# EAGLE design MSP430F5529_Relays_PressureSensor (EAGLE 9.4.1)
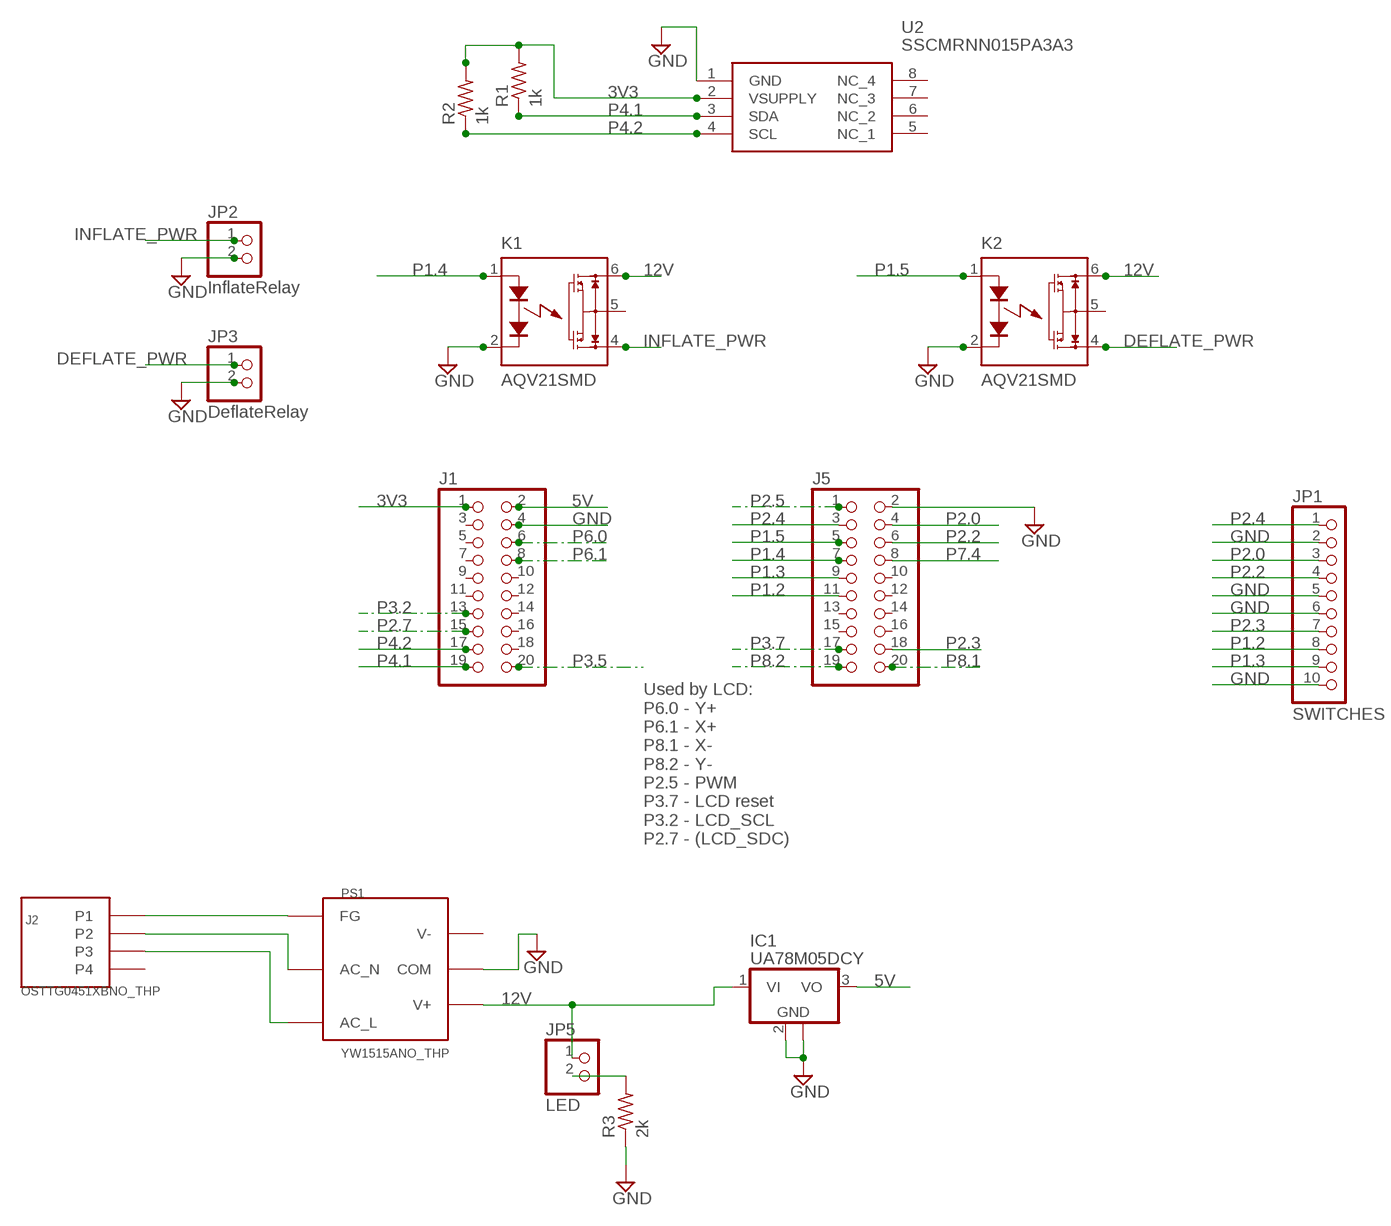
[diagram p0: schematic, sheet 1]

## Parts
IC1  UA78M05DCY  [SOT223]
J1  PINHD-2X10  [2X10]
J2  OSTTG0451XBNO_THP  [TERM_4PIN_5.08MM_NO_THP]
J5  PINHD-2X10  [2X10]
JP1  SWITCHES  PINHD-1X10/90  [1X10/90]
JP2  InflateRelay  PINHD-1X2/90  [1X02/90]
JP3  DeflateRelay  PINHD-1X2/90  [1X02/90]
JP5  LED  PINHD-1X2/90  [1X02/90]
K1  AQV21SMD  [DIL06SMD]
K2  AQV21SMD  [DIL06SMD]
PS1  YW1515ANO_THP  [YW15_NO_THP]
R1  1k  R-US_M1206  [M1206]
R2  1k  R-US_M1206  [M1206]
R3  2k  R-US_M1206  [M1206]
U2  SSCMRNN015PA3A3  [SOP254P1330X598-8N]

## Nets
3V3: J1.1 R1.2 R2.2 U2.2(VSUPPLY)
5V: IC1.3(VO) J1.2
12V: IC1.1(VI) JP5.1 K1.6(D1) K2.6(D1) PS1.P4(V+)
AC_L: J2.P3 PS1.P3(AC_L)
AC_N: J2.P2 PS1.P2(AC_N)
DEFLATE_PWR: JP3.1 K2.4(D2)
FG: J2.P1 PS1.P1(FG)
GND: IC1.2(GND) IC1.4(GND) J1.4 J5.2 JP1.2 JP1.5 JP1.6 JP1.10 JP2.2 JP3.2 K1.2(K) K2.2(K) PS1.P5(COM) R3.1 U2.1(GND)
INFLATE_PWR: JP2.1 K1.4(D2)
N$1: JP5.2 R3.2
P1.2: J5.11 JP1.8
P1.3: J5.9 JP1.9
P1.4: J5.7 K1.1(A)
P1.5: J5.5 K2.1(A)
P2.0: J5.4 JP1.3
P2.2: J5.6 JP1.4
P2.3: J5.18 JP1.7
P2.4: J5.3 JP1.1
P2.5: J5.1
P2.7: J1.15
P3.2: J1.13
P3.5: J1.20
P3.7: J5.17
P4.1: J1.19 R1.1 U2.3(SDA)
P4.2: J1.17 R2.1 U2.4(SCL)
P6.0: J1.6
P6.1: J1.8
P7.4: J5.8
P8.1: J5.20
P8.2: J5.19
Unconnected: J1.3 J1.5 J1.7 J1.9 J1.10 J1.11 J1.12 J1.14 J1.16 J1.18 J2.P4 J5.10 J5.12 J5.13 J5.14 J5.15 J5.16 K1.5(S) K2.5(S) U2.5(NC_1) U2.6(NC_2) U2.7(NC_3) U2.8(NC_4)

## Notes on the sheet
- Used by LCD:
  P6.0 - Y+
  P6.1 - X+
  P8.1 - X-
  P8.2 - Y-
  P2.5 - PWM
  P3.7 - LCD reset
  P3.2 - LCD_SCL
  P2.7 - (LCD_SDC)

## Power pins joined to a net without a drawn wire
V-: PS1.P6(V-)

## Library data of the parts
IC1 = linear:UA78M*: POSITIVE-VOLTAGE REGULATORS Source: http://focus.ti.com/lit/ds/symlink/ua78m33.pdf
J1 J5 = pinhead:PINHD-2X10: PIN HEADER
J2 = MasterSPIS:OSTTG0451XB: OSTTG045100B TERMINAL BLOCK 5.08MM 4POS Angled Screw
JP1 = pinhead:PINHD-1X10: PIN HEADER
JP2 JP3 JP5 = pinhead:PINHD-1X2: PIN HEADER
K1 K2 = relay:AQV*: PhotoMOS Relay NAiS Source: Data sheet <http://www.panasonic-electric-works.com/catalogues/downloads/photomos/ds_x615_en_aqv10_20.pdf>; MF: AROMAT/ MATSUSHITA; MPN: AQV210S; OC_FARNELL: unknown; OC_NEWARK: 95F6433
PS1 = MasterSPIS:YW1515A: Cosel YW15 AC-DC Power supply YW1512A - +/-12V 0.65A YW1515A - +/-12V 0.50A
R1-R3 = resistor:R-US_: RESISTOR, American symbol
U2 = SamacSys_Parts:SSCMRNN015PA3A3: Board Mount Pressure Sensors SMT, Sing Rad Barbed Absolute, 3.3V Source: Datasheet <https://componentsearchengine.com/Datasheets/1/SSCMRNN015PA3A3.pdf>; DESCRIPTION: Board Mount Pressure Sensors SMT, Sing Rad Barbed Absolute, 3.3V; HEIGHT: 5.98mm; MANUFACTURER_NAME: Honeywell; MANUFACTURER_PART_NUMBER: SSCMRNN015PA3A3

## Board
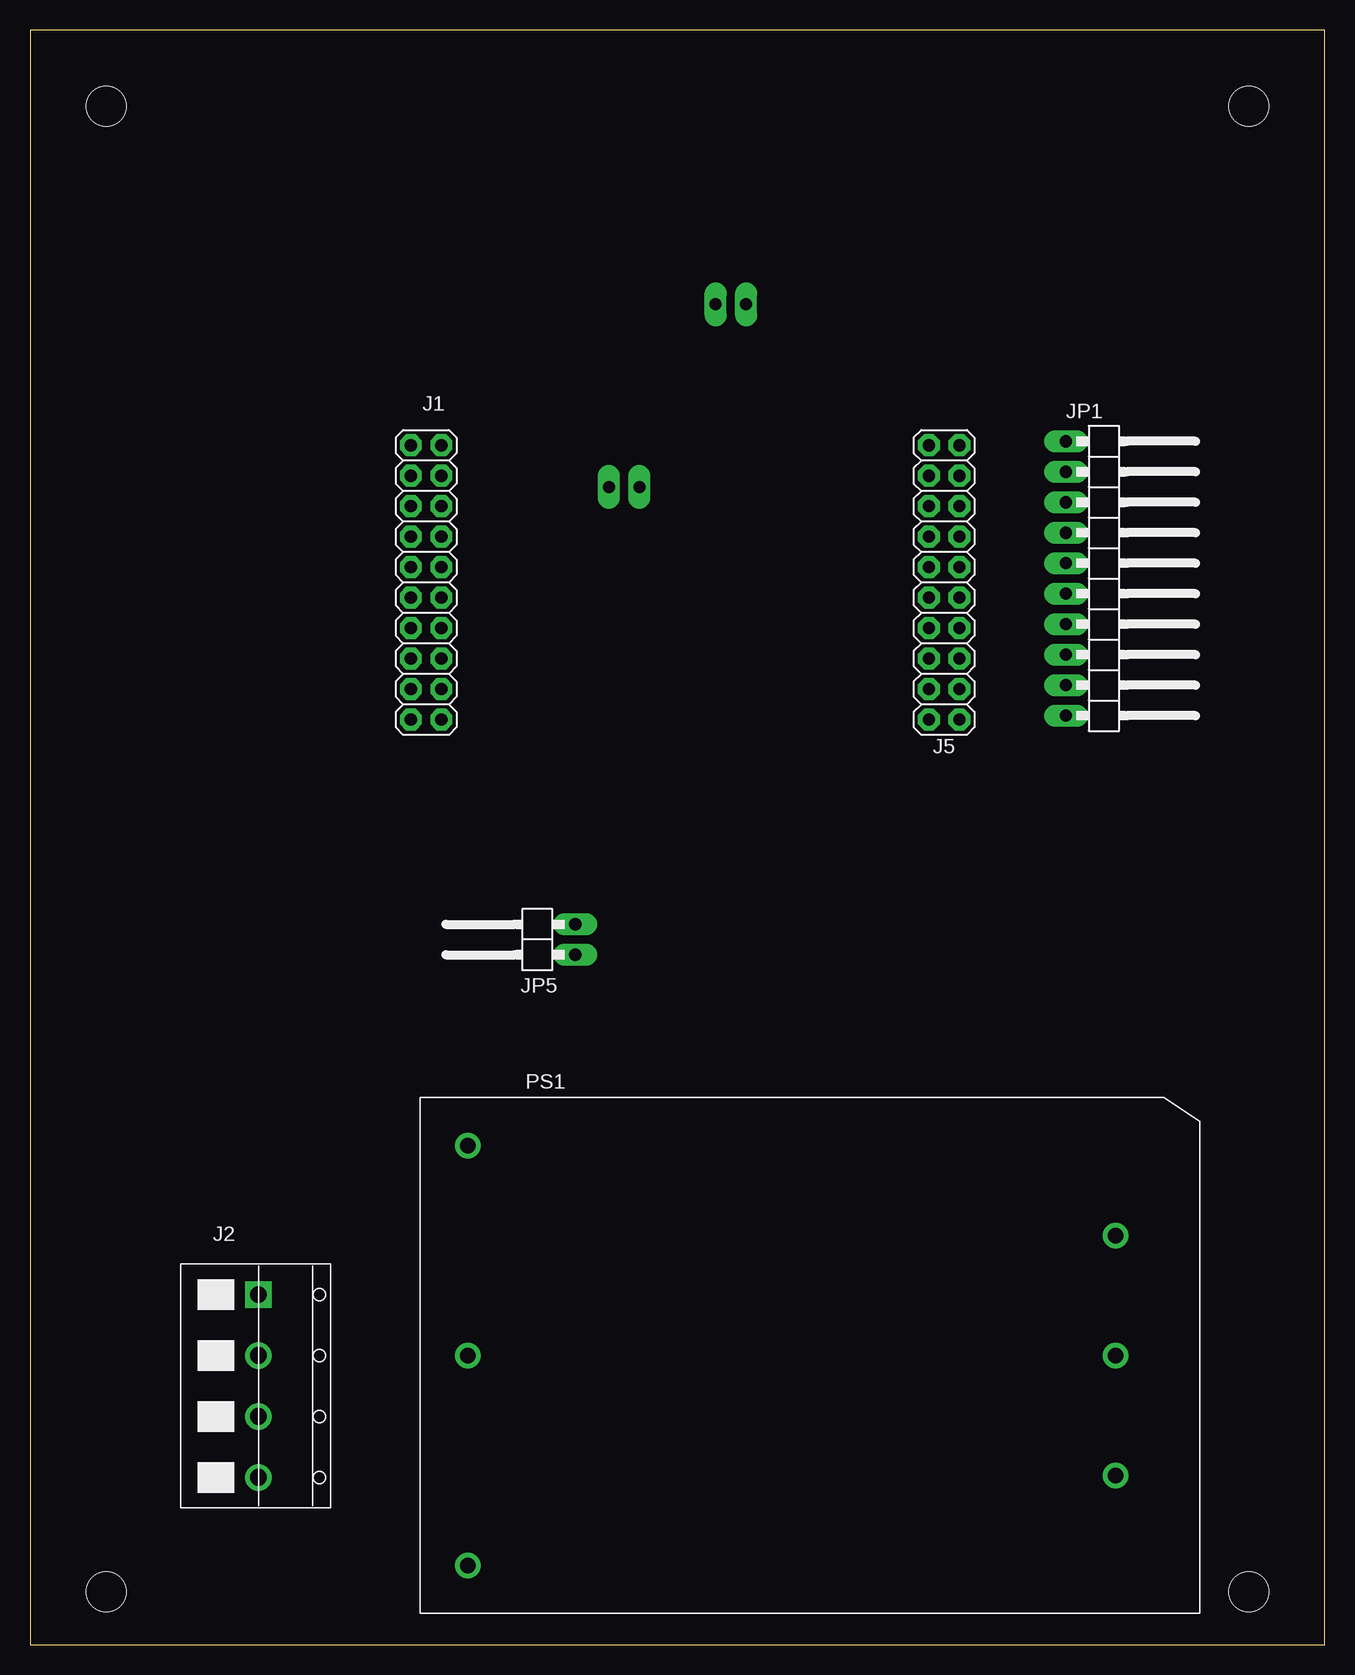
[diagram p1: board, top side]
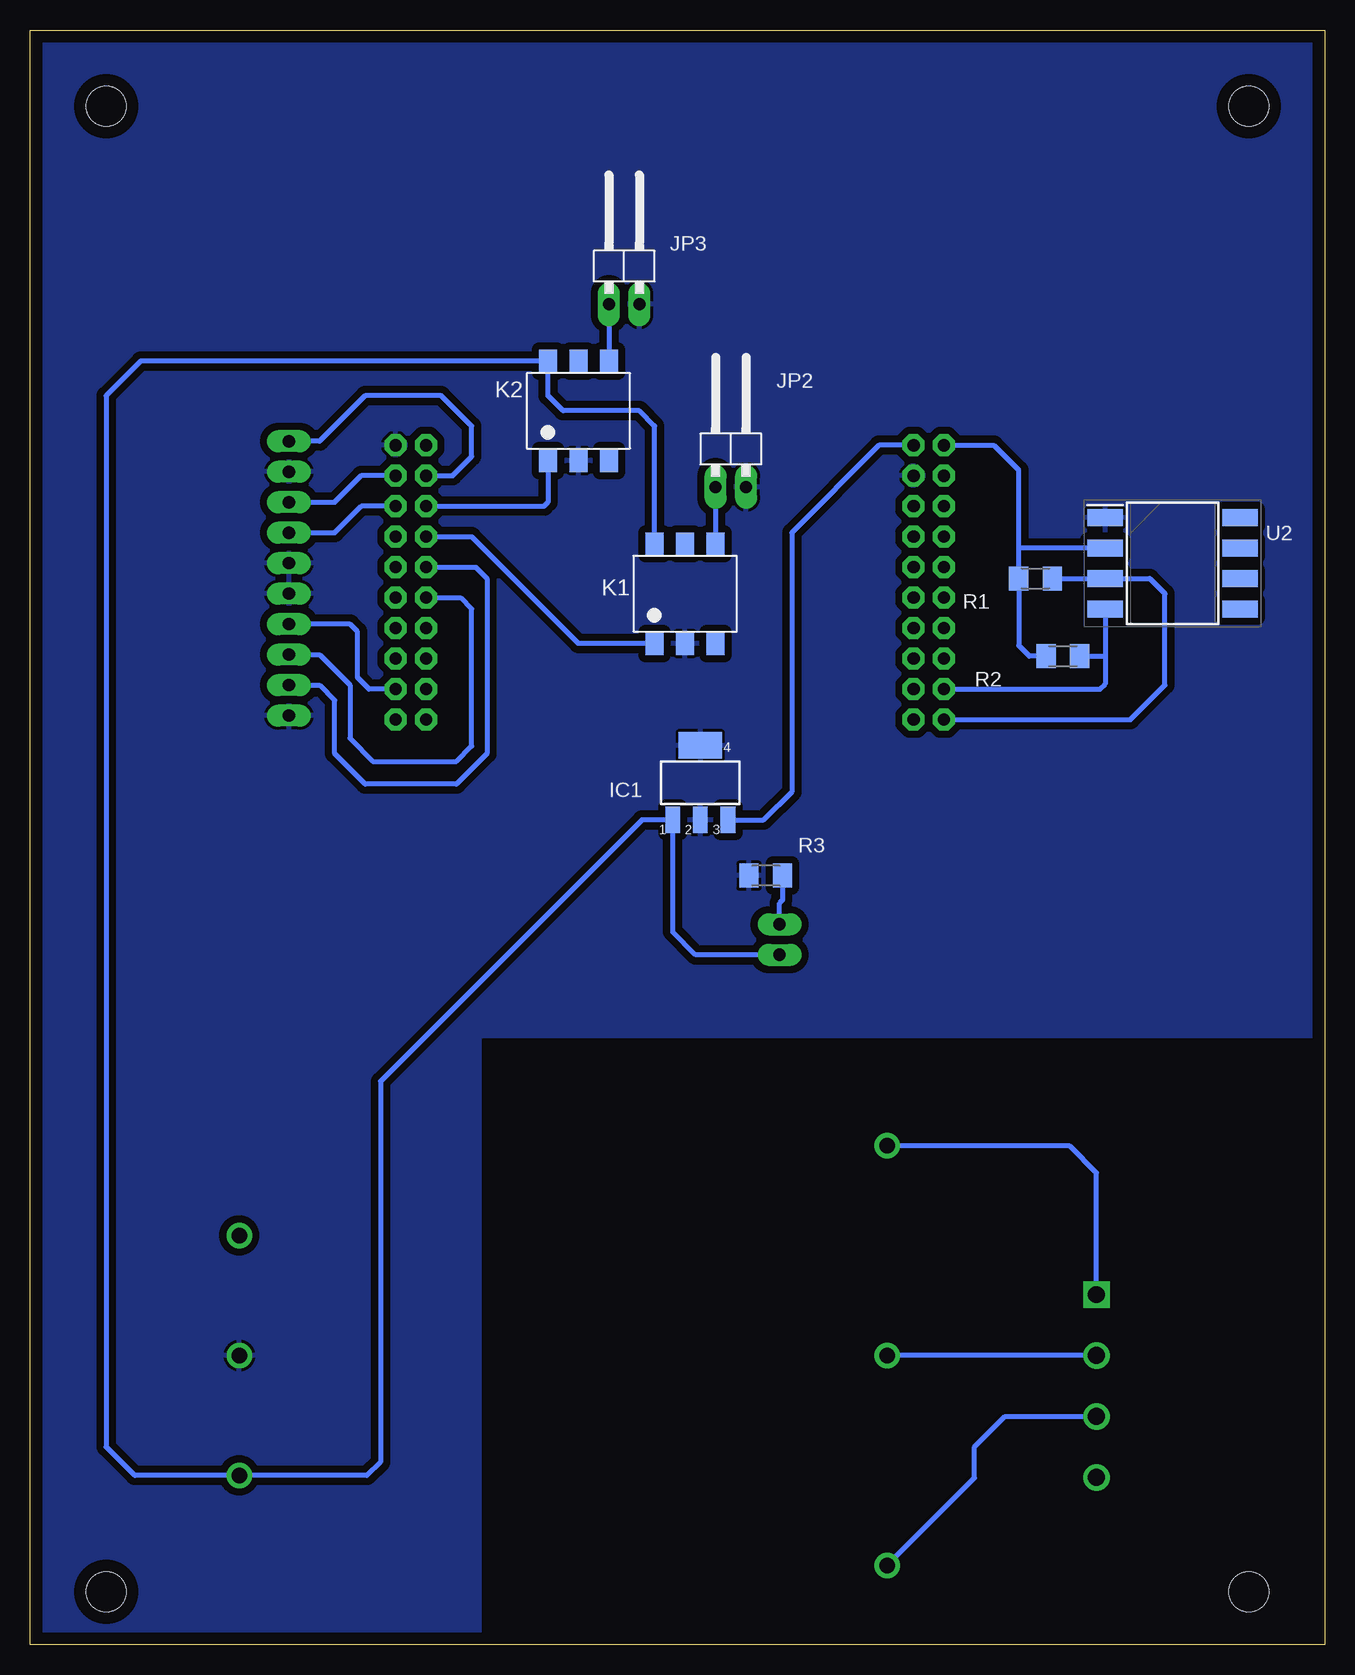
[diagram p2: board, bottom side, seen from below]

Size 107.95 x 134.62 mm. Coordinates in mm from the lower left corner, seen from the top.
Outline: 0,0 107.95,0 107.95,134.62 0,134.62 0,0
Copper layers (1*16): Top 0.035mm / dielectric 1.5mm / Bottom 0.035mm
Design rules "SPIS_LPKF_16mil": minimum track width 10mil, minimum drill 24mil, track to track 16mil, track to pad 16mil, pad to pad 16mil, via to via 16mil, smd to smd 16mil, copper to edge 40mil, drill to drill 8mil, minimum pad ring 16mil, minimum via ring 16mil, stop-mask expansion 4mil, vias tented up to drill 0mil, thermal gap 10mil
Holes 3.3 mm at 6.35,128.27 101.6,128.27 101.6,4.44 6.35,4.44

### Footprints (pad centres in the part's own frame; a part is rotated, then mirrored left to right if it is on the bottom)
SOT223 = smd 1.219 x 2.235: 1 -2.311,-3.099; 2 0,-3.099; 3 2.311,-3.099 | smd 3.6 x 2.2: 4 0,3.099
2X10 = drill 1.016 octagon: 1 -11.43,-1.27; 2 -11.43,1.27; 3 -8.89,-1.27; 4 -8.89,1.27; 5 -6.35,-1.27; 6 -6.35,1.27; 7 -3.81,-1.27; 8 -3.81,1.27; 9 -1.27,-1.27; 10 -1.27,1.27; 11 1.27,-1.27; 12 1.27,1.27; 13 3.81,-1.27; 14 3.81,1.27; 15 6.35,-1.27; 16 6.35,1.27; 17 8.89,-1.27; 18 8.89,1.27; 19 11.43,-1.27; 20 11.43,1.27
TERM_4PIN_5.08MM_NO_THP = drill 1.4 square: P1 -7.62,0 | drill 1.4: P2 -2.54,0; P3 2.54,0; P4 7.62,0
1X10/90 = drill 1.016 long: 1 -11.43,-3.81; 2 -8.89,-3.81; 3 -6.35,-3.81; 4 -3.81,-3.81; 5 -1.27,-3.81; 6 1.27,-3.81; 7 3.81,-3.81; 8 6.35,-3.81; 9 8.89,-3.81; 10 11.43,-3.81
1X02/90 = drill 1.016 long: 1 -1.27,-3.81; 2 1.27,-3.81
DIL06SMD = smd 1.5 x 1.9: 1 -2.54,-4.15; 2 0,-4.15; 3 2.54,-4.15; 4 2.54,4.15; 5 0,4.15; 6 -2.54,4.15
YW15_NO_THP = drill 1.3: P1 -27,17.5; P2 -27,0; P3 -27,-17.5; P4 27,-10; P5 27,0; P6 27,10
M1206 = smd 1.6 x 2: 1 -1.4,0; 2 1.4,0
SOP254P1330X598-8N = smd 2.95 x 1.4: 1 -5.625,3.81; 2 -5.625,1.27; 3 -5.625,-1.27; 4 -5.625,-3.81; 5 5.625,-3.81; 6 5.625,-1.27; 7 5.625,1.27; 8 5.625,3.81

### Placement (x,y rotation side)
IC1  52.07,71.88 0 bottom
J1  33.02,88.57 270 top
J2  19.05,21.59 270 top
J5  76.2,88.57 270 top
JP1  90.17,88.9 270 top
JP2  49.53,100.33 0 bottom
JP3  58.42,115.57 0 bottom
JP5  41.66,58.8 90 top
K1  53.34,87.63 0 bottom
K2  62.23,102.87 0 bottom
PS1  63.5,24.13 0 top
R1  24.13,88.9 180 bottom
R2  21.84,82.42 180 bottom
R3  46.61,64.13 0 bottom
U2  12.7,90.17 0 bottom

### Tracks (layer width: path | path; a pad name or v marks a point on that pad's centre or on a via)
3V3
  Bottom 0.406: R2.2 24.64,82.42 25.53,83.31 R1.2 25.53,91.44 | 25.53,91.44 25.53,97.92 27.61,100 J1.1 | U2.2 25.53,91.44
5V
  Bottom 0.406: IC1.3 46.79,68.78 44.45,71.12 44.45,92.71 37.16,100 J1.2
12V
  Bottom 0.406: K1.6 55.88,101.6 57.15,102.87 63.5,102.87 64.77,104.14 K2.6 98.72,107.02 101.6,104.14 101.6,16.51 99.22,14.13 PS1.P4 79.85,14.13 78.74,15.24 78.74,46.99 56.95,68.78 IC1.1 54.38,59.46 52.45,57.53 JP5.1
AC_L
  Bottom 0.406: PS1.P3 29.21,13.92 29.21,16.51 26.67,19.05 J2.P3
AC_N
  Bottom 0.406: J2.P2 PS1.P2
DEFLATE_PWR
  Bottom 0.406: JP3.1 K2.4
FG
  Bottom 0.406: J2.P1 19.05,39.37 21.31,41.63 PS1.P1
GND
  pour Bottom (isolate 0.61): 0.63,134.62 107.95,134.62 107.95,0 70.48,0 70.48,5.71 70.48,50.8 0.63,50.8
INFLATE_PWR
  Bottom 0.406: JP2.1 K1.4
N$1
  Bottom 0.406: R3.2 45.21,62.11 45.47,61.85 JP5.2
P1.2
  Bottom 0.406: J5.11 72.06,87.3 71.12,86.36 71.12,74.93 72.39,73.66 79.38,73.66 81.28,75.56 81.28,80.01 83.82,82.55 JP1.8
P1.3
  Bottom 0.406: JP1.9 83.82,80.01 82.55,78.74 82.55,74.3 80.01,71.75 72.39,71.75 69.85,74.3 69.85,88.9 70.79,89.84 J5.9
P1.4
  Bottom 0.406: K1.1 62.23,83.48 71.13,92.38 J5.7
P1.5
  Bottom 0.406: J5.5 65.1,94.92 64.77,95.25 K2.1
P2.0
  Bottom 0.406: JP1.3 82.55,95.25 80.34,97.46 J5.4
P2.2
  Bottom 0.406: J5.6 80.34,94.92 82.55,92.71 JP1.4
P2.3
  Bottom 0.406: JP1.7 81.28,85.09 80.64,84.45 80.64,80.64 79.68,79.68 J5.18
P2.4
  Bottom 0.406: J5.3 72.72,97.46 71.12,99.06 71.12,101.6 73.66,104.14 80.01,104.14 83.82,100.33 JP1.1
P4.1
  Bottom 0.406: R1.1 U2.3 14.6,88.9 13.33,87.63 13.33,80.01 16.2,77.14 J1.19
P4.2
  Bottom 0.406: J1.17 18.74,79.68 18.32,80.1 18.32,82.55 | U2.4 18.32,82.55 | R2.1 18.45,82.42 18.32,82.55